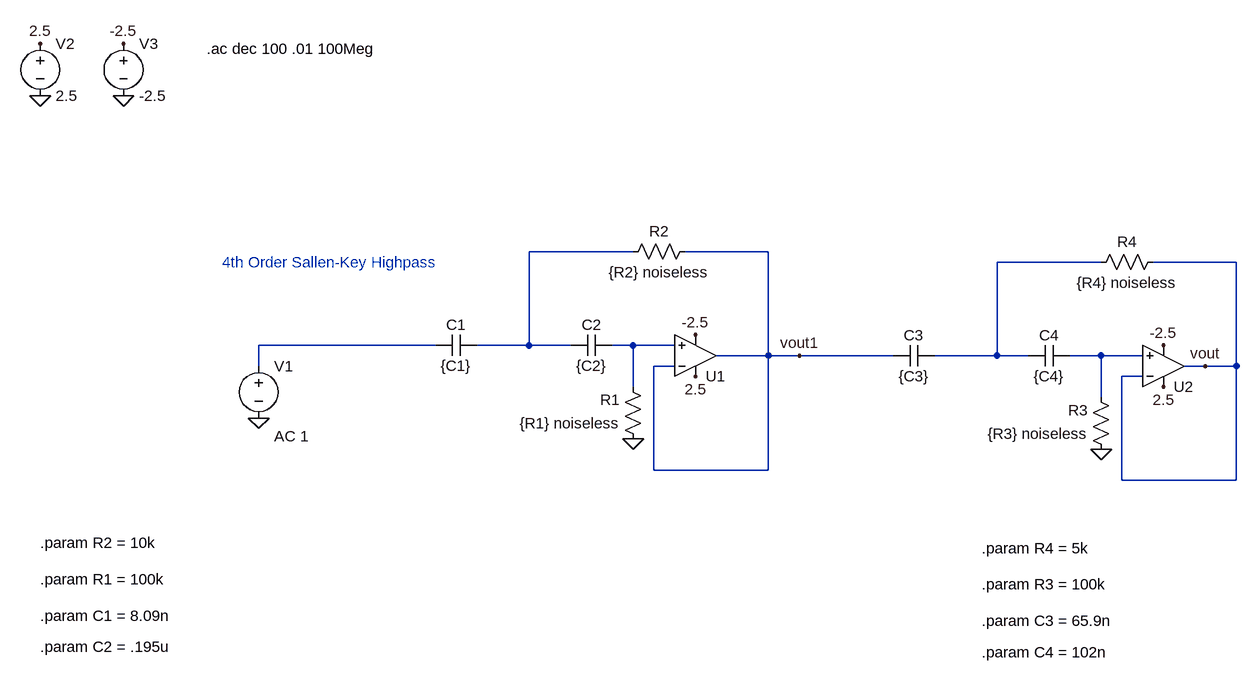
[diagram p0: schematic sallen_key_4th_order_HP.asc]
sallen_key_4th_order_HP.asc, the LTspice schematic file:
Version 4
SHEET 1 1916 856
WIRE 464 0 304 0
WIRE 672 0 544 0
WIRE 1184 16 1024 16
WIRE 1392 16 1264 16
WIRE 160 144 -112 144
WIRE 304 144 304 0
WIRE 304 144 224 144
WIRE 368 144 304 144
WIRE 464 144 432 144
WIRE 528 144 464 144
WIRE 672 160 672 0
WIRE 672 160 592 160
WIRE 720 160 672 160
WIRE 864 160 720 160
WIRE 1024 160 1024 16
WIRE 1024 160 928 160
WIRE 1072 160 1024 160
WIRE 1184 160 1136 160
WIRE 1248 160 1184 160
WIRE -112 176 -112 144
WIRE 528 176 496 176
WIRE 1344 176 1312 176
WIRE 1392 176 1392 16
WIRE 1392 176 1344 176
WIRE 1248 192 1216 192
WIRE 464 208 464 144
WIRE 1184 224 1184 160
WIRE 496 336 496 176
WIRE 672 336 672 160
WIRE 672 336 496 336
WIRE 1216 352 1216 192
WIRE 1392 352 1392 176
WIRE 1392 352 1216 352
FLAG 560 192 2.5
FLAG 560 128 -2.5
FLAG 464 288 0
FLAG -112 256 0
FLAG -448 -320 2.5
FLAG -320 -320 -2.5
FLAG -448 -240 0
FLAG -320 -240 0
FLAG 1280 208 2.5
FLAG 1280 144 -2.5
FLAG 1184 304 0
FLAG 1344 176 vout
FLAG 720 160 vout1
SYMBOL Opamps\\UniversalOpamp2 560 160 M180
SYMATTR InstName U1
SYMATTR Value2 Avol=10Meg GBW=10Meg Slew=10Meg
SYMBOL res 448 16 R270
WINDOW 0 32 56 VTop 2
WINDOW 3 0 56 VBottom 2
SYMATTR InstName R2
SYMATTR Value {R2} noiseless
SYMBOL res 480 304 R180
WINDOW 0 36 76 Left 2
WINDOW 3 36 40 Left 2
SYMATTR InstName R1
SYMATTR Value {R1} noiseless
SYMBOL cap 432 128 R90
WINDOW 0 0 32 VBottom 2
WINDOW 3 32 32 VTop 2
SYMATTR InstName C2
SYMATTR Value {C2}
SYMBOL cap 160 160 R270
WINDOW 0 32 32 VTop 2
WINDOW 3 0 32 VBottom 2
SYMATTR InstName C1
SYMATTR Value {C1}
SYMBOL voltage -112 160 R0
WINDOW 123 24 124 Left 2
WINDOW 39 0 0 Left 0
WINDOW 3 24 44 Left 2
SYMATTR Value2 AC 1
SYMATTR Value ""
SYMATTR InstName V1
SYMBOL voltage -448 -336 R0
WINDOW 123 0 0 Left 0
WINDOW 39 0 0 Left 0
SYMATTR InstName V2
SYMATTR Value 2.5
SYMBOL voltage -320 -336 R0
WINDOW 123 0 0 Left 0
WINDOW 39 0 0 Left 0
SYMATTR InstName V3
SYMATTR Value -2.5
SYMBOL Opamps\\UniversalOpamp2 1280 176 M180
SYMATTR InstName U2
SYMATTR Value2 Avol=10Meg GBW=10Meg Slew=10Meg
SYMBOL res 1280 0 R90
WINDOW 0 0 56 VBottom 2
WINDOW 3 32 56 VTop 2
SYMATTR InstName R4
SYMATTR Value {R4} noiseless
SYMBOL res 1200 320 R180
WINDOW 0 36 76 Left 2
WINDOW 3 36 40 Left 2
SYMATTR InstName R3
SYMATTR Value {R3} noiseless
SYMBOL cap 1136 144 R90
WINDOW 0 0 32 VBottom 2
WINDOW 3 32 32 VTop 2
SYMATTR InstName C4
SYMATTR Value {C4}
SYMBOL cap 864 176 R270
WINDOW 0 32 32 VTop 2
WINDOW 3 0 32 VBottom 2
SYMATTR InstName C3
SYMATTR Value {C3}
TEXT -168 16 Left 2 ;4th Order Sallen-Key Highpass
TEXT -192 -312 Left 2 !.ac dec 100 .01 100Meg
TEXT -448 448 Left 2 !.param R2 = 10k
TEXT -448 560 Left 2 !.param C1 = 8.09n
TEXT -448 608 Left 2 !.param C2 = .195u
TEXT -448 504 Left 2 !.param R1 = 100k
TEXT 1000 456 Left 2 !.param R4 = 5k
TEXT 1000 568 Left 2 !.param C3 = 65.9n
TEXT 1000 616 Left 2 !.param C4 = 102n
TEXT 1000 512 Left 2 !.param R3 = 100k

The netlist it stands for:
* sallen_key_4th_order_HP.asc
XU1 N004 vout1 2.5 -2.5 vout1 level.2 Avol=10Meg GBW=10Meg Slew=10Meg ilimit=25m rail=0 Vos=0 phimargin=45 en=0 enk=0 in=0 ink=0 Rin=500Meg  ; pins IN+ IN- V+ V- OUT
R2 N001 vout1 {R2} noiseless
R1 0 N004 {R1} noiseless
C2 N004 N001 {C2}
C1 N003 N001 {C1}
V1 N003 0 AC 1
V2 2.5 0 2.5
V3 -2.5 0 -2.5
XU2 N005 vout 2.5 -2.5 vout level.2 Avol=10Meg GBW=10Meg Slew=10Meg ilimit=25m rail=0 Vos=0 phimargin=45 en=0 enk=0 in=0 ink=0 Rin=500Meg  ; pins IN+ IN- V+ V- OUT
R4 vout N002 {R4} noiseless
R3 0 N005 {R3} noiseless
C4 N005 N002 {C4}
C3 vout1 N002 {C3}
* 4th Order Sallen-Key Highpass
.ac dec 100 .01 100Meg
.param R2 = 10k
.param C1 = 8.09n
.param C2 = .195u
.param R1 = 100k
.param R4 = 5k
.param C3 = 65.9n
.param C4 = 102n
.param R3 = 100k
.lib UniversalOpamps2.sub
.backanno
.end